# Altium project Quail_2.0.PrjPcb (part 2 of 2)

## Sheet Blink_Blink_Beep_Boop.SchDoc: Blinks and Boops
size Legal; DocumentNumber: 8; SheetNumber: 8; SheetTotal: 8; Project: Olympus
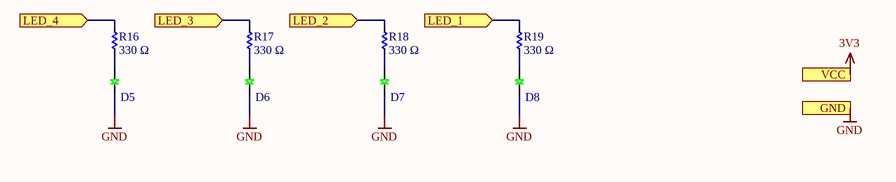
[diagram p4: Blink_Blink_Beep_Boop.SchDoc]

### Parts
(Parts that share a designator on the sheet are numbered #1, #2 ... from top to bottom, then left to right.)
D5  LED_C503B-GCS-CB0C0781  [LED_TH_5MM]  (value not drawn)
D6  LED_C503B-GCS-CB0C0781  [LED_TH_5MM]  (value not drawn)
D7#1  LED_C503B-GCS-CB0C0781  [LED_TH_5MM]  (value not drawn)
D8#1  LED_C503B-GCS-CB0C0781  [LED_TH_5MM]  (value not drawn)
R16  Resistance: 330 Ω  [R0603]  (hidden comment: 311-330HRCT-ND)
R17  Resistance: 330 Ω  [R0603]  (hidden comment: 311-330HRCT-ND)
R18  Resistance: 330 Ω  [R0603]  (hidden comment: 311-330HRCT-ND)
R19  Resistance: 330 Ω  [R0603]  (hidden comment: 311-330HRCT-ND)

### Ports
GND (in), LED_1 (in), LED_2 (in), LED_3 (in), LED_4 (in), VCC (in)

### Nets
GND: D5.2(K) D6.2(K) D7#1.2(K) D8#1.2(K) ; port GND
LED1: R19.2 ; port LED_1
LED2: R18.2 ; port LED_2
LED3: R17.2 ; port LED_3
LED4: R16.2 ; port LED_4
NetD5_1: D5.1(A) R16.1
NetD6_1: D6.1(A) R17.1
NetD7#1_1: D7#1.1(A) R18.1
NetD8#1_1: D8#1.1(A) R19.1

### Notes on the sheet
- PROJECT
- SHEET
- Powered By
- Sheet
- of
- REVISION
- ssi.stanford.edu
- ENGINEER
- REVIEWER
- REVIEWED ON

### Library data of the parts
D5 D6 D7#1 D8#1 = CMP-033-0070-3: LED GREEN CLEAR 5MM ROUND T/H; Manufacturer: Cree; Lens Colour: Colorless; Luminous Intensity: 24850mcd; Viewing Angle: 30°; Forward Current: 20mA; Forward Voltage: 3.2V; Lens Style: Dome; Dominant Wavelength: 527nm; Power Rating: 120mW; Reverse Voltage (DC): 5V; Number of LEDs: 1; Manufacturer Part Number: C503B-GCS-CB0C0781; Stock 1: 191; Pricing 1: 1=0.25, 10=0.236, 100=0.2184, 1000=0.1954, 50000=0.1814 (USD); Mount: Through Hole; Case/Package: Radial; Colour: Green; Min Operating Temperature: -40°C; Max Operating Temperature: 95°C; Illumination Colour: Green; Packaging: Bulk; Package Quantity: 500; Lens Transparency: Clear; Test Current: 20mA; Wavelength: 527nm; Length: 5.8mm; Height: 12.7mm; Width: 5mm; ComponentLink1URL: http://www.mouser.com/ds/2/90/cree.C503B%20BAS%20BAN%20BCS%20BCN%20GAS%20GAN%20GCS%20GCN%201094[1]-310350.pdf; ComponentLink1Description: http://www.mouser.com/ds/2/90/cree.C503B%20BAS%20BAN%20BCS%20BCN%20GAS%20GAN%20GCS%20GCN%201094[1]-310350.pdf; ComponentLink2URL: http://www.cree.com/led-components/media/documents/C503B-BAS-BAN-BCS-BCN-GAS-GAN-GCS-GCN-1094.pdf; ComponentLink2Description: http://www.cree.com/led-components/media/documents/C503B-BAS-BAN-BCS-BCN-GAS-GAN-GCS-GCN-1094.pdf; Design Item ID: LED_C503B-GCS-CB0C0781; Source: diode.SchLib
R16-R19 = CMP-126-0120-2: RES SMD 330 OHM 1% 1/10W 0603; Manufacturer Part Number: RC0603FR-07330RL; Manufacturer: Yageo; Resistance (Sortable): 330; Power (Watts): 0.1W, 1/10W; Temperature Coefficient: ±100ppm/°C; Datasheets: http://www.yageo.com/documents/recent/PYu-RC_Group_51_RoHS_L_9.pdf; Image: //media.digikey.com/Renders/Yageo%20Renders/0603-(1608-Metric).jpg; Tolerance: ±1%; Operating Temperature: -55°C ~ 155°C

## Sheet SAMD51.SchDoc
size A3
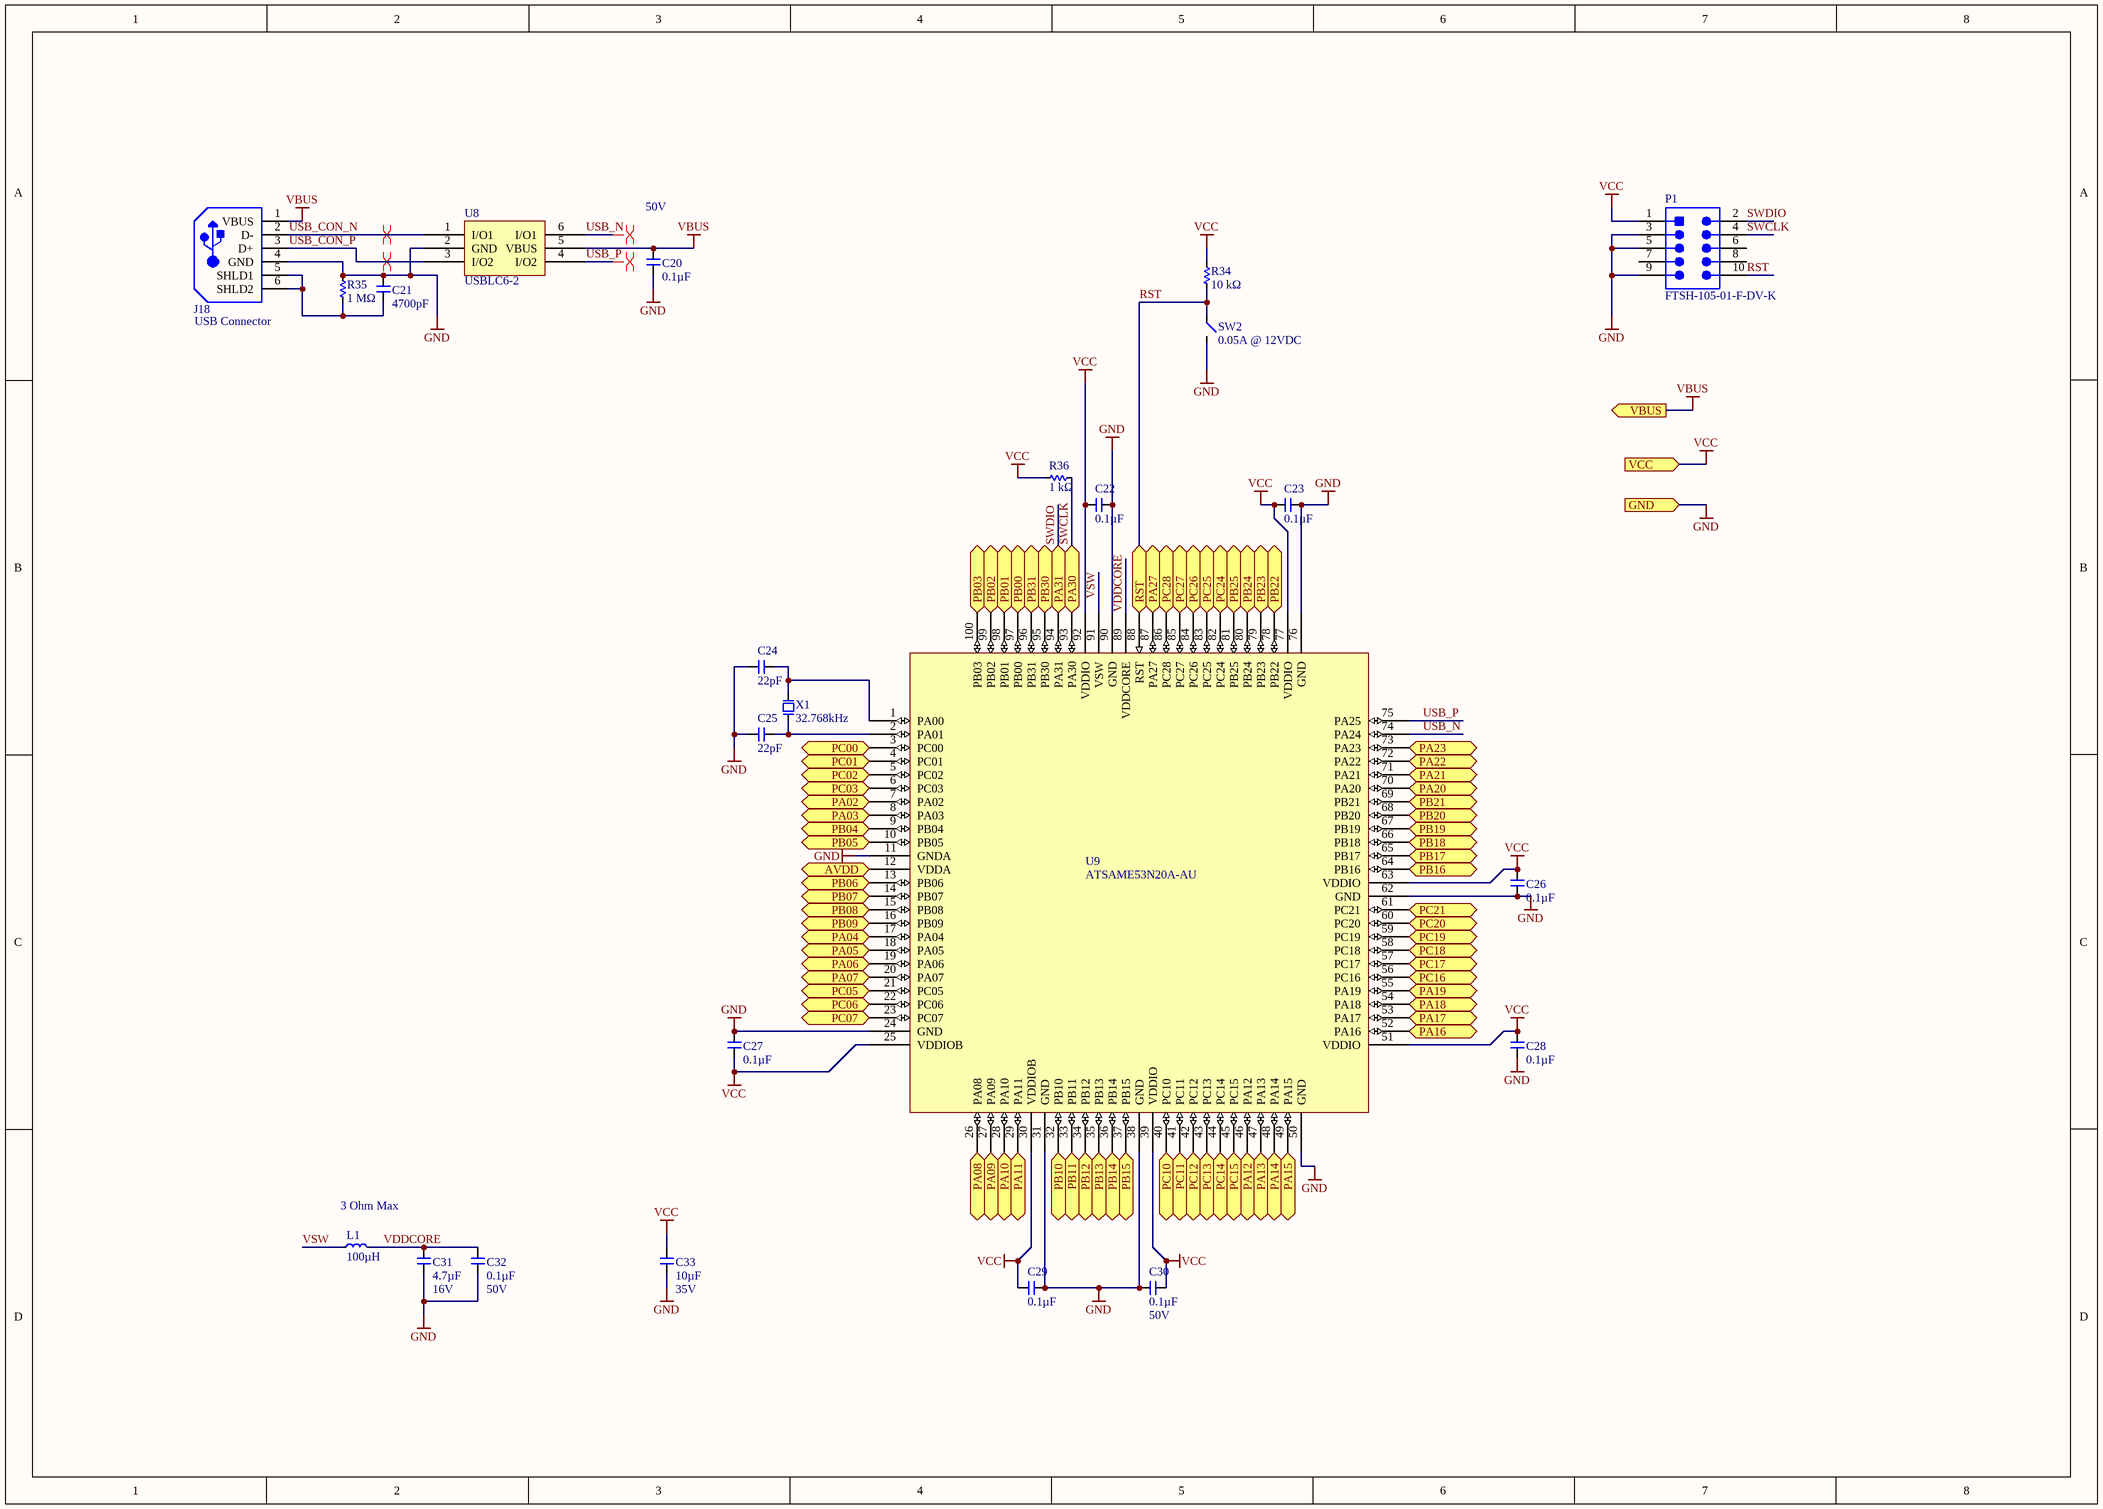
[diagram p5: SAMD51.SchDoc]

### Parts
(Parts that share a designator on the sheet are numbered #1, #2 ... from top to bottom, then left to right.)
C20  Capacitance (shorthand): 0.1µF  Rated Voltage: 50V  [C0603]  (hidden comment: 490-1519-1-ND)
C21  Capacitance (shorthand): 4700pF  [C0603]  (hidden comment: 490-1506-1-ND)
C22#1  Capacitance (shorthand): 0.1µF  [C0603]  (hidden comment: 490-1519-1-ND)
C23#1  Capacitance (shorthand): 0.1µF  [C0603]  (hidden comment: 490-1519-1-ND)
C24#1  Capacitance (shorthand): 22pF  [C0603]  (hidden comment: 490-1411-1-ND)
C25#1  Capacitance (shorthand): 22pF  [C0603]  (hidden comment: 490-1411-1-ND)
C26#1  Capacitance (shorthand): 0.1µF  [C0603]  (hidden comment: 490-1519-1-ND)
C27#1  Capacitance (shorthand): 0.1µF  [C0603]  (hidden comment: 490-1519-1-ND)
C28  Capacitance (shorthand): 0.1µF  [C0603]  (hidden comment: 490-1519-1-ND)
C29  Capacitance (shorthand): 0.1µF  [C0603]  (hidden comment: 490-1519-1-ND)
C30  Capacitance (shorthand): 0.1µF  Rated Voltage: 50V  [C0603]  (hidden comment: 490-1519-1-ND)
C31  Capacitance (shorthand): 4.7µF  Rated Voltage: 16V  [C0603]  (hidden comment: 311-1785-1-ND)
C32  Capacitance (shorthand): 0.1µF  Rated Voltage: 50V  [C0603]  (hidden comment: 490-1519-1-ND)
C33  Capacitance (shorthand): 10µF  Rated Voltage: 35V  [C0603]  (hidden comment: 490-13248-1-ND)
J18#1  USBR-B-S-S-O-TH  [SMTC-USBR-TH-4_V]  (value not drawn)
L1  DC Resistance (DCR): 3 Ohm Max  Inductance: 100µH  [C1210]  (hidden comment: IND_BRL3225T101K)
P1  FTSH-105-01-F-DV-K  [SMTC-FTSH-105-01-L-DV-K_V]
R34#1  Resistance: 10 kΩ  [R0603]  (hidden comment: 311-10.0KHRCT-ND)
R35#1  Resistance: 1 MΩ  [R0603]  (hidden comment: 311-1.00MHRCT-ND)
R36#1  Resistance: 1 kΩ  [R0603]  (hidden comment: 311-1.00KHRCT-ND)
SW2  Contact Rating @ Voltage: 0.05A @ 12VDC  [SWITCH_FSM4JSMATR]  (hidden comment: SWITCH_FSM4JSMATR)
U8  USBLC6-2  [6SOT23]
U9  ATSAME53N20A-AU  [TSQFP50P1600X1600X120-100N]
X1  Frequency: 32.768kHz  [XTAL_TXC_9HT10]  (hidden comment: XTAL_9HT10-32.768KEZF-T)

### Ports
AVDD (bidir), GND (in), PA02 (bidir), PA03 (bidir), PA04 (bidir), PA05 (bidir), PA06 (bidir), PA07 (bidir), PA08 (bidir), PA09 (bidir), PA10 (bidir), PA11 (bidir), PA12 (bidir), PA13 (bidir), PA14 (bidir), PA15 (bidir), PA16 (bidir), PA17 (bidir), PA18 (bidir), PA19 (bidir), PA20 (bidir), PA21 (bidir), PA22 (bidir), PA23 (bidir), PA27 (bidir), PA30 (bidir), PA31 (bidir), PB00 (bidir), PB01 (bidir), PB02 (bidir), PB03 (bidir), PB04 (bidir), PB05 (bidir), PB06 (bidir), PB07 (bidir), PB08 (bidir), PB09 (bidir), PB10 (bidir), PB11 (bidir), PB12 (bidir), PB13 (bidir), PB14 (bidir), PB15 (bidir), PB16 (bidir), PB17 (bidir), PB18 (bidir), PB19 (bidir), PB20 (bidir), PB21 (bidir), PB22 (bidir), PB23 (bidir), PB24 (bidir), PB25 (bidir), PB30 (bidir), PB31 (bidir), PC00 (bidir), PC01 (bidir), PC02 (bidir), PC03 (bidir), PC05 (bidir), PC06 (bidir), PC07 (bidir), PC10 (bidir), PC11 (bidir), PC12 (bidir), PC13 (bidir), PC14 (bidir), PC15 (bidir), PC16 (bidir), PC17 (bidir), PC18 (bidir), PC19 (bidir), PC20 (bidir), PC21 (bidir), PC24 (bidir), PC25 (bidir), PC26 (bidir), PC27 (bidir), PC28 (bidir), RST (bidir), VBUS (out), VCC (in)

### Nets
GND: C20.2 C21.1 C22#1.1 C23#1.1 C24#1.1 C25#1.1 C26#1.1 C27#1.1 C28.1 C29.2 C30.2 C31.1 C32.2 C33.1 J18#1.4(GND) P1.3 P1.5 P1.9 R35#1.2 SW2.2 U8.2(GND) U9.11(GNDA) U9.24(GND) U9.31(GND) U9.38(GND) U9.50(GND) U9.62(GND) U9.76(GND) U9.90(GND) ; port GND
VBUS: C20.1 J18#1.1(VBUS) U8.5(VBUS) ; port VBUS
VCC: C22#1.2 C23#1.2 C26#1.2 C27#1.2 C28.2 C29.1 C30.1 C33.2 P1.1 R34#1.1 R36#1.2 U9.12(VDDA) U9.25(VDDIOB) U9.30(VDDIOB) U9.39(VDDIO) U9.51(VDDIO) U9.63(VDDIO) U9.77(VDDIO) U9.92(VDDIO) ; port VCC, port AVDD  [project net 3V3]
ADC_SYNC: U9.87(PA27) ; port PA27
BatterySense: U9.15(PB08) ; port PB08
BUSY: U9.83(PC25) ; port PC25
CAN_STBY_1: U9.68(PB20) ; port PB20
CurrentSense: U9.16(PB09) ; port PB09
DIO1: U9.82(PC24) ; port PC24
ETH_INT: U9.96(PB31) ; port PB31
GPS_PPS: U9.78(PB22) ; port PB22
LED1: U9.64(PB16) ; port PB16
LED2: U9.65(PB17) ; port PB17
LED3: U9.66(PB18) ; port PB18
LED4: U9.67(PB19) ; port PB19
NRESET: U9.84(PC26) ; port PC26
PWR_FLT: U9.6(PC03) ; port PC03
RST: P1.10 R34#1.2 SW2.1 U9.88(RST) ; port RST
SD_CLK: U9.33(PB11) ; port PB11
SD_CMD: U9.26(PA08) ; port PA08
SD_DAT0: U9.27(PA09) ; port PA09
SD_DAT1: U9.28(PA10) ; port PA10
SD_DAT2: U9.29(PA11) ; port PA11
SD_DAT3: U9.32(PB10) ; port PB10
SOLENOID_1: U9.45(PC15) ; port PC15
SOLENOID_2: U9.44(PC14) ; port PC14
SOLENOID_3: U9.43(PC13) ; port PC13
SOLENOID_4: U9.42(PC12) ; port PC12
SOLENOID_5: U9.41(PC11) ; port PC11
SOLENOID_6: U9.40(PC10) ; port PC10
SOLENOID_7: U9.20(PA07) ; port PA07
SOLENOID_8: U9.19(PA06) ; port PA06
SOLENOID_9: U9.18(PA05) ; port PA05
SOLENOID_10: U9.17(PA04) ; port PA04
SOLENOID_11: U9.14(PB07) ; port PB07
SOLENOID_12: U9.13(PB06) ; port PB06
SQB_CS: U9.58(PC18) ; port PC18
SQB_MICO: U9.59(PC19) ; port PC19
SQB_MOCI: U9.57(PC17) ; port PC17
SQB_SCK: U9.56(PC16) ; port PC16
SWCLK: P1.4 R36#1.1 U9.93(PA30) ; port PA30
SWDIO: P1.2 U9.94(PA31) ; port PA31
USB_CON_N: J18#1.2(D-) U8.1(I/O1)
USB_CON_P: J18#1.3(D+) U8.3(I/O2)
USB_N: U8.6(I/O1) U9.74(PA24)
USB_P: U8.4(I/O2) U9.75(PA25)
VDDCORE: C31.2 C32.1 L1.1 U9.89(VDDCORE)
VSW: L1.2 U9.91(VSW)
NetC21_2: C21.2 J18#1.5(SHLD1) J18#1.6(SHLD2) R35#1.1
NetC24#1_2: C24#1.2 U9.1(PA00) X1.2
NetC25#1_2: C25#1.2 U9.2(PA01) X1.1
NetTP1_1: U9.23(PC07) ; port PC07
NetTP2_1: U9.22(PC06) ; port PC06
NetTP3_1: U9.21(PC05) ; port PC05
NetTP30_1: U9.10(PB05) ; port PB05
NetTP31_1: U9.95(PB30) ; port PB30
NetTP32_1: U9.52(PA16) ; port PA16
NetTP33_1: U9.61(PC21) ; port PC21
NetTP34_1: U9.9(PB04) ; port PB04
NetTP35_1: U9.97(PB00) ; port PB00
NetTP36_1: U9.98(PB01) ; port PB01
NetTP37_1: U9.99(PB02) ; port PB02
NetTP38_1: U9.100(PB03) ; port PB03
NetTP39_1: U9.8(PA03) ; port PA03
NetTP40_1: U9.7(PA02) ; port PA02
NetTP41_1: U9.3(PC00) ; port PC00
NetTP42_1: U9.4(PC01) ; port PC01
NetTP43_1: U9.5(PC02) ; port PC02
NetU9_34: U9.34(PB12) ; port PB12
NetU9_35: U9.35(PB13) ; port PB13
NetU9_36: U9.36(PB14) ; port PB14
NetU9_37: U9.37(PB15) ; port PB15
NetU9_46: U9.46(PA12) ; port PA12
NetU9_47: U9.47(PA13) ; port PA13
NetU9_48: U9.48(PA14) ; port PA14
NetU9_49: U9.49(PA15) ; port PA15
NetU9_53: U9.53(PA17) ; port PA17
NetU9_54: U9.54(PA18) ; port PA18
NetU9_55: U9.55(PA19) ; port PA19
NetU9_60: U9.60(PC20) ; port PC20
NetU9_69: U9.69(PB21) ; port PB21
NetU9_70: U9.70(PA20) ; port PA20
NetU9_71: U9.71(PA21) ; port PA21
NetU9_72: U9.72(PA22) ; port PA22
NetU9_73: U9.73(PA23) ; port PA23
NetU9_79: U9.79(PB23) ; port PB23
NetU9_80: U9.80(PB24) ; port PB24
NetU9_81: U9.81(PB25) ; port PB25
NetU9_85: U9.85(PC27) ; port PC27
NetU9_86: U9.86(PC28) ; port PC28

Not connected (* = marked no-connect by the designer): P1 6 7 8

### Layout directives
differential pair: USB_CON_N, USB_CON_P, USB_N, USB_P

### Notes on the sheet
- (near J18#1) USB Connector
- Title
- Size:
- Date:
- A4
- Number:
- Time:
- Revision:
- Sheet
- of
- File:

### Library data of the parts
C20 C22#1 C23#1 C26#1 C27#1 C28-C30 C32 = CMP-119-0065-1: CAP CER 0603 0.1µF X7R 50V 10%; Manufacturer: Murata Electronics North America; Capacitance - pF (Machine readable): #NAME?; Dielectric: X7R
  C22#1 C23#1 C26#1 C27#1 C28 C29: Rated Voltage: 50V
C21 = CMP-119-0049-1: CAP CER 0603 4700pF X7R 50V 10%; Manufacturer: Murata Electronics North America; Capacitance - pF (Machine readable): #NAME?; Dielectric: X7R; Rated Voltage: 50V
C24#1 C25#1 = CMP-119-0008-1: CAP CER 22PF 50V C0G/NP0 0603; Manufacturer: Murata Electronics North America; Capacitance - pF (Machine readable): 22; Dielectric: C0G, NP0; Rated Voltage: 50V
C31 = CMP-119-0070-1: CAP CER 4.7UF 16V X5R 0603 10%; Manufacturer: Yageo; Capacitance - pF (Machine readable): #NAME?; Dielectric: X5R
C33 = CMP-119-0071-1: CAP CER 10UF 35V X5R 0603 20%; Manufacturer: Murata Electronics North America; Capacitance - pF (Machine readable): #NAME?; Dielectric: X5R
J18#1 = CMP-00011-3: Conn USB F 4 POS 2.5mm Solder RA Thru-Hole 4 Terminal 1 Port Tray; Max Voltage Rating (AC): 30V; USB Standard: USB 2.0; Number of Contacts: 4; Gender: Receptacle; Number of Ports: 1; Contact Plating: Gold; REACH SVHC: No SVHC; Radiation Hardening: No; Mount: Through Hole,Horizontal; Packaging: Tray; Length: 14.9mm; Max Operating Temperature: 85°C; Termination: Solder; Depth: 16.5mm; Connector Type: USB; Contact Material: Bronze; Pitch: 2.5mm; Series: -; Number of Terminals/Pins: 4; Orientation: Right Angle; Package Quantity: 1; Min Operating Temperature: -50°C; Housing Material: Thermoplastic
L1 = CMP-052-0010-1: INDUCTOR 100UH 270MA 1210 SMD; Manufacturer: Taiyo Yuden; Current - Temperature Rise: 250mA; Tolerance: ±10%; Shielding: Unshielded; Frequency - Self Resonant: 5MHz; Frequency - Test: 100kHz; Manufacturer Part Number: BRL3225T101K; RoHS: RoHS Compliant; Current - Saturation: 270mA; Q @ Freq: -; Applications: Power Supplies; Material - Core: -; Package / Case: 1210 (3225 Metric); Mounting Type: Surface Mount; Packaging: Cut Tape (CT); Operating Temperature: -40°C ~ 105°C; ComponentLink1URL: http://www.yuden.co.jp/ut/product/pdf/wound07_e.pdf; ComponentLink1Description: Datasheet; Current: 270mA; Stock 1: 84687; Source: inductor.SchLib; Pricing 1: 1=0.16, 10=0.155, 50=0.145, 100=0.1354, 500=0.10638, 1000=0.08704 (GBP); Design Item ID: IND_BRL3225T101K
P1 = CMP-2000-05352-1: Male Header, Pitch 1.27 mm, 2 x 5 Position, Height 6.12 mm, RoHS, Tube; Manufacturer: Samtec; Number of Positions: 10; Connector Type: Header,Shrouded; Number of Positions Loaded: All; Row Spacing: 0.050"(1.27mm); Fastening Type: -; Package Reference: FTSH-105-01-L-DV-K; Termination: Solder; Package URL: http://suddendocs.samtec.com/prints/ftsh-1xx-xx-xxx-dv-xxx-footprint.pdf; Number of Rows: 2; Contact Finish Thickness: 3µin(0.08µm); Contact Type: MalePin; Manufacturer URL: http://www.samtec.com/; Series: FTSH; Features: -; Contact Finish: Gold; Color: Black; Family: RectangularConnectors-Headers,MalePins; Datasheet URL: http://suddendocs.samtec.com/prints/ftsh-1xx-xx-xxx-dv-xxx-mkt.pdf; Package Description: Male Header, Pitch 1.27 mm, 2 x 5 Position, Height 5.97 mm, Tail Length 4.32 mm; Mounting Type: SurfaceMount; Datasheet Version: Rev. ET, 10/1995; Category: Connectors,Interconnects; Packaging: Tube; Contact Mating Length: 0.120"(3.05mm); Pitch: 0.050"(1.27mm)
R34#1 = CMP-126-0273-2: RES SMD 10K OHM 1% 1/10W 0603; Manufacturer Part Number: RC0603FR-0710KL; Manufacturer: Yageo; Resistance (Sortable): 10000; Power (Watts): 0.1W, 1/10W; Temperature Coefficient: ±100ppm/°C; Datasheets: http://www.yageo.com/documents/recent/PYu-RC_Group_51_RoHS_L_9.pdf; Image: //media.digikey.com/Renders/Yageo%20Renders/0603-(1608-Metric).jpg; Tolerance: ±1%; Operating Temperature: -55°C ~ 155°C
R35#1 = CMP-126-0484-2: RES SMD 1M OHM 1% 1/10W 0603; Manufacturer Part Number: RC0603FR-071ML; Manufacturer: Yageo; Resistance (Sortable): 1000000; Power (Watts): 0.1W, 1/10W; Temperature Coefficient: ±100ppm/°C; Datasheets: http://www.yageo.com/documents/recent/PYu-RC_Group_51_RoHS_L_9.pdf; Image: //media.digikey.com/Renders/Yageo%20Renders/0603-(1608-Metric).jpg; Tolerance: ±1%; Operating Temperature: -55°C ~ 155°C
R36#1 = CMP-126-0172-2: RES SMD 1K OHM 1% 1/10W 0603; Manufacturer Part Number: RC0603FR-071KL; Manufacturer: Yageo; Resistance (Sortable): 1000; Power (Watts): 0.1W, 1/10W; Temperature Coefficient: ±100ppm/°C; Datasheets: http://www.yageo.com/documents/recent/PYu-RC_Group_51_RoHS_L_9.pdf; Image: //media.digikey.com/Renders/Yageo%20Renders/0603-(1608-Metric).jpg; Tolerance: ±1%; Operating Temperature: -55°C ~ 155°C
SW2 = CMP-062-0009-1: SWITCH TACTILE SPST-NO 0.05A 12V; Manufacturer: TE Connectivity; Switch Function: Off-Mom; Actuator Type: Standard; Actuator Height off PCB, from Pins: 5.00mm; Actuator Orientation: Top Actuated; Outline: 6.00mm x 6.00mm; Illumination: Non-Illuminated; Operating Force: 160gf; Actuator Material: Polyphenylene Sulfide (PPS); Switch Travel: 0.25mm; Mechanical Life: 100,000 Cycles; Manufacturer Part Number: FSM4JSMATR; RoHS: RoHS Compliant; Stock 1: 24144; Pricing 1: 1=0.36, 10=0.34, 25=0.2912, 50=0.2474, 100=0.2377, 250=0.21344, 500=0.20374 (USD); Circuit: SPST-NO; Mounting Type: Surface Mount; Termination Style: Gull Wing; Illumination Voltage (Nominal): -; Illumination Type, Color: -; Ingress Protection: -; Features: -; Packaging: Cut Tape (CT); Operating Temperature: -35°C ~ 85°C; ComponentLink1URL: http://www.te.com/commerce/DocumentDelivery/DDEController?Action=srchrtrv&DocNm=2-1437565-7&DocType=Customer+Drawing&DocLang=English; ComponentLink1Description: Datasheet; Source: miscellaneous.SchLib; Design Item ID: SWITCH_FSM4JSMATR
U8 = CMP-038-0001-1: Manufacturer: STMicroelectronics; Manufacturer Part Number: USBLC6-2SC6; Unidirectional Channels: 2; Voltage - Reverse Standoff (Typ): 5.25V; Voltage - Breakdown (Min): 6V; Voltage - Clamping (Max) @ Ipp: 17V; Current - Peak Pulse (10/1000µs): 5A (8/20µs); Power Line Protection: Yes; RoHS: RoHS Compliant; Stock 1: 31719; Pricing 1: 1=0.51, 10=0.411, 100=0.2802, 500=0.21012, 1000=0.15759 (USD); Packaging: Cut Tape (CT); Part Status: Active; Bidirectional Channels: -; Power - Peak Pulse: -; Applications: Ethernet; Capacitance @ Frequency: -; Operating Temperature: -40°C ~ 125°C (TJ); Mounting Type: Surface Mount; Package / Case: SOT-23-6; Supplier Device Package: SOT-23-6; ComponentLink1URL: http://www.st.com/web/en/resource/technical/document/datasheet/CD00050750.pdf; ComponentLink1Description: http://www.st.com/web/en/resource/technical/document/datasheet/CD00050750.pdf; Design Item ID: USBLC6-2; Source: ic_analog.SchLib
U9 = CMP-025-0003-5: MCU 32-bit ARM Cortex M4F RISC 1MB Flash 3.3V 100-Pin TQFP Tray
X1 = CMP-066-0008-1: CRYSTAL 32.768 KHZ 12.5 PF SMD; Manufacturer: TXC CORPORATION; Frequency Tolerance: ±10ppm; ESR (Equivalent Series Resistance): 70 kOhm; Operating Mode: Fundamental; Load Capacitance: 12.5pF; Manufacturer Part Number: 9HT10-32.768KEZF-T; RoHS: RoHS Compliant; Stock 1: 5250; Pricing 1: 1=1.88, 10=1.625, 50=1.425, 100=1.125, 500=0.95, 1000=0.75 (USD); Frequency Stability: -; Operating Temperature: -40°C ~ 85°C; Ratings: -; Mounting Type: Surface Mount; Package / Case: 2-SMD; Size / Dimension: 0.126" L x 0.059" W (3.20mm x 1.50mm); Height: 0.033" (0.85mm); Packaging: Cut Tape (CT); ComponentLink1URL: http://www.txccrystal.com/images/pdf/9ht10.pdf; ComponentLink1Description: Datasheet; Design Item ID: XTAL_9HT10-32.768KEZF-T; Source: oscillator.SchLib

## Sheet SD.SchDoc
size A4
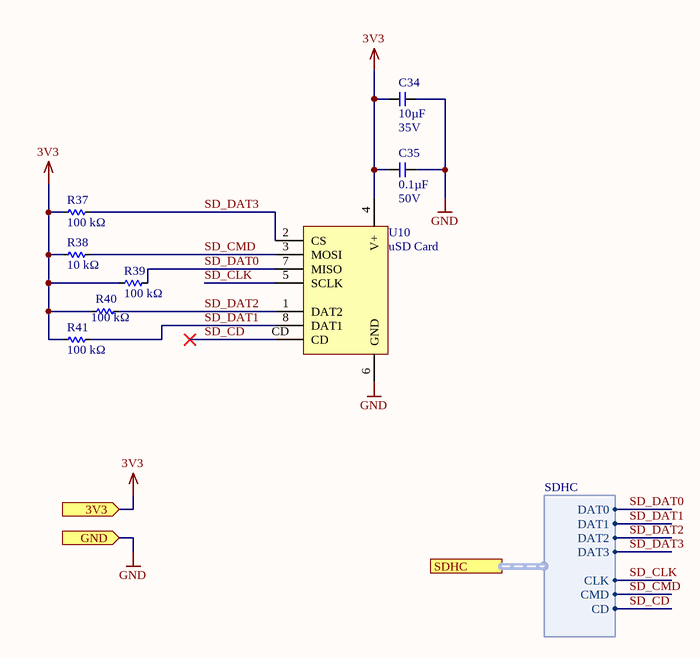
[diagram p6: SD.SchDoc]

### Parts
(Parts that share a designator on the sheet are numbered #1, #2 ... from top to bottom, then left to right.)
C34  Capacitance (shorthand): 10µF  Rated Voltage: 35V  [C0603]  (hidden comment: 490-13248-1-ND)
C35  Capacitance (shorthand): 0.1µF  Rated Voltage: 50V  [C0603]  (hidden comment: 490-1519-1-ND)
R37#1  Resistance: 100 kΩ  [R0603]  (hidden comment: 311-100KHRCT-ND)
R38#1  Resistance: 10 kΩ  [R0603]  (hidden comment: 311-10.0KHRCT-ND)
R39#1  Resistance: 100 kΩ  [R0603]  (hidden comment: 311-100KHRCT-ND)
R40#1  Resistance: 100 kΩ  [R0603]  (hidden comment: 311-100KHRCT-ND)
R41#1  Resistance: 100 kΩ  [R0603]  (hidden comment: 311-100KHRCT-ND)
U10  uSD Card  [MICROSD_CARD_SOCKET]

### Ports
3V3 (in), GND (in), SDHC (harness SDHC)

### Harnesses
SDHC: DAT3, DAT0, DAT2, DAT1, CLK, CMD, CD

### Nets
3V3: C34.2 C35.1 R37#1.1 R38#1.1 R39#1.1 R40#1.1 R41#1.1 U10.4(V+) ; port 3V3
GND: C34.1 C35.2 U10.6(GND) ; port GND
SD_CD: U10.CD ; port SDHC.CD
SD_CLK: U10.5(SCLK) ; port SDHC.CLK
SD_CMD: R38#1.2 U10.3(MOSI) ; port SDHC.CMD
SD_DAT0: R39#1.2 U10.7(MISO) ; port SDHC.DAT0
SD_DAT1: R41#1.2 U10.8(DAT1) ; port SDHC.DAT1
SD_DAT2: R40#1.2 U10.1(DAT2) ; port SDHC.DAT2
SD_DAT3: R37#1.2 U10.2(CS) ; port SDHC.DAT3

### Notes on the sheet
- Title
- Size:
- Date:
- A4
- Number:
- Time:
- Revision:
- Sheet
- of
- File:

### Library data of the parts
C34 = CMP-119-0071-1: as C33 on sheet SAMD51; Dielectric: X5R
C35 = CMP-119-0065-1: as C20 on sheet SAMD51; Dielectric: X7R
R37#1 R39#1 R40#1 R41#1 = CMP-126-0382-2: RES SMD 100K OHM 1% 1/10W 0603; Manufacturer Part Number: RC0603FR-07100KL; Manufacturer: Yageo; Resistance (Sortable): 100000; Power (Watts): 0.1W, 1/10W; Temperature Coefficient: ±100ppm/°C; Datasheets: http://www.yageo.com/documents/recent/PYu-RC_Group_51_RoHS_L_9.pdf; Image: //media.digikey.com/Renders/Yageo%20Renders/0603-(1608-Metric).jpg; Tolerance: ±1%; Operating Temperature: -55°C ~ 155°C
R38#1 = CMP-126-0273-2: as R34#1 on sheet SAMD51; Datasheets: http://www.yageo.com/documents/recent/PYu-RC_Group_51_RoHS_L_9.pdf; Image: //media.digikey.com/Renders/Yageo%20Renders/0603-(1608-Metric).jpg; Tolerance: ±1%; Operating Temperature: -55°C ~ 155°C
U10 = CMP-030-0037-1: MICROSD CARD HOLDER, PUSH-PUSH; Manufacturer: 3M; Manufacturer Part Number: 2908-05WB-MG; Card Type: Secure Digital - microSD™; Number of Positions: 10 (8 + 2); Connector Type: Connector and Ejector; Insertion, Removal Method: Push In, Push Out; RoHS: RoHS Compliant; Stock 1: 32313; Pricing 1: 1=3.6, 10=3.458, 25=3.1704, 50=3.0262, 100=2.882, 250=2.52176, 500=2.4497, 1000=2.08945 (USD); Packaging: Cut Tape (CT); Ejector Side: -; Mounting Type: Surface Mount, Right Angle; Features: Switch; Height Above Board: 0.073" (1.85mm); Mounting Feature: Normal, Standard - Top; Contact Finish: Gold; Contact Finish Thickness: 15µin (0.38µm); ComponentLink1URL: http://multimedia.3m.com/mws/media/416257O/3mtm-card-connector-microsdtm-2900-series-ts2197.pdf; ComponentLink1Description: http://multimedia.3m.com/mws/media/416257O/3mtm-card-connector-microsdtm-2900-series-ts2197.pdf; Source: connector.SchLib; Design Item ID: MICRO_SD_CARD_HOLDER

## Sheet Radio.SchDoc
size Legal
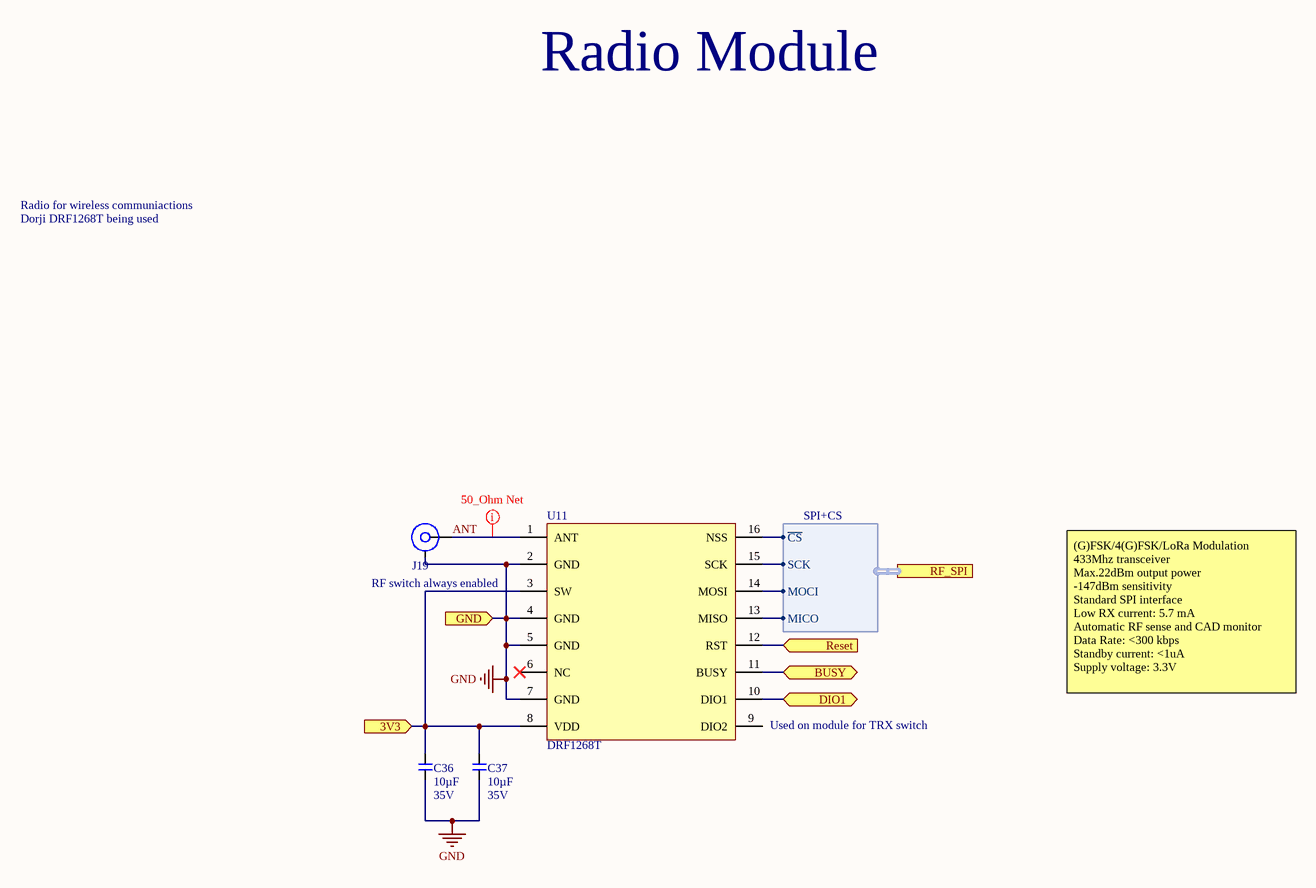
[diagram p7: Radio.SchDoc]

### Parts
(Parts that share a designator on the sheet are numbered #1, #2 ... from top to bottom, then left to right.)
C36  Capacitance (shorthand): 10µF  Rated Voltage: 35V  [C0603]  (hidden comment: 490-13248-1-ND)
C37  Capacitance (shorthand): 10µF  Rated Voltage: 35V  [C0603]  (hidden comment: 490-13248-1-ND)
J19#1  SMA_SAMTEC_TH_RA  [SMA_SAMTEC_SMA-J-P-X-RA-TH1]  (value not drawn)
U11  DRF1268T  [DRF1268T]

### Ports
3V3 (in), BUSY (bidir), DIO1 (bidir), GND (in), Reset (in), RF_SPI (harness SPI+CS)

### Harnesses
SPI+CS: SCK, MOCI, MICO, ~{CS}

### Nets
3V3: C36.1 C37.1 U11.3(SW) U11.8(VDD) ; port 3V3
GND: C36.2 C37.2 J19#1.GND U11.2(GND) U11.4(GND) U11.5(GND) U11.7(GND) ; port GND
ANT: J19#1.SIG U11.1(ANT)
BUSY: U11.11(BUSY) ; port BUSY
DIO1: U11.10(DIO1) ; port DIO1
NRESET: U11.12(RST) ; port Reset
NetU9_70: U11.13(MISO) ; port RF_SPI.MICO
NetU9_71: U11.16(NSS) ; port RF_SPI.~{CS}
NetU9_72: U11.15(SCK) ; port RF_SPI.SCK
NetU9_73: U11.14(MOSI) ; port RF_SPI.MOCI

Not connected (* = marked no-connect by the designer): U11 6(NC)* 9(DIO2)

### Layout directives
rule Clearance Constraint [Generic clearance = 0mil, and 21 value(s) for objects]: ANT

### Notes on the sheet
- Radio Module
- Radio for wireless communiactions
- Dorji DRF1268T being used
- RF switch always enabled
- (near U11) Used on module for TRX switch
- (G)FSK/4(G)FSK/LoRa Modulation
  433Mhz transceiver
  Max.22dBm output power
  -147dBm sensitivity
  Standard SPI interface
  Low RX current: 5.7 mA
  Automatic RF sense and CAD monitor
  Data Rate: <300 kbps
  Standby current: <1uA
  Supply voltage: 3.3V
- PROJECT
- SHEET
- Powered By
- Sheet
- of
- REVISION
- ssi.stanford.edu
- ENGINEER
- REVIEWER
- REVIEWED ON

### Library data of the parts
C36 C37 = CMP-119-0071-1: as C33 on sheet SAMD51; Dielectric: X5R
J19#1 = CMP-030-0020-1: Source: connector.SchLib; Design Item ID: SMA_SAMTEC_TH_RA
U11 = CMP-025-0002-1: Dorji DRF1268T LoRa Module with SX1262 IC and TCXO; Design Item ID: RFM_Module

## Sheet SolenoidsAndPressure.SchDoc: Solenoids & Pressure Transducers
size Legal; DocumentNumber: 8; SheetNumber: 8; SheetTotal: 8; Project: Olympus
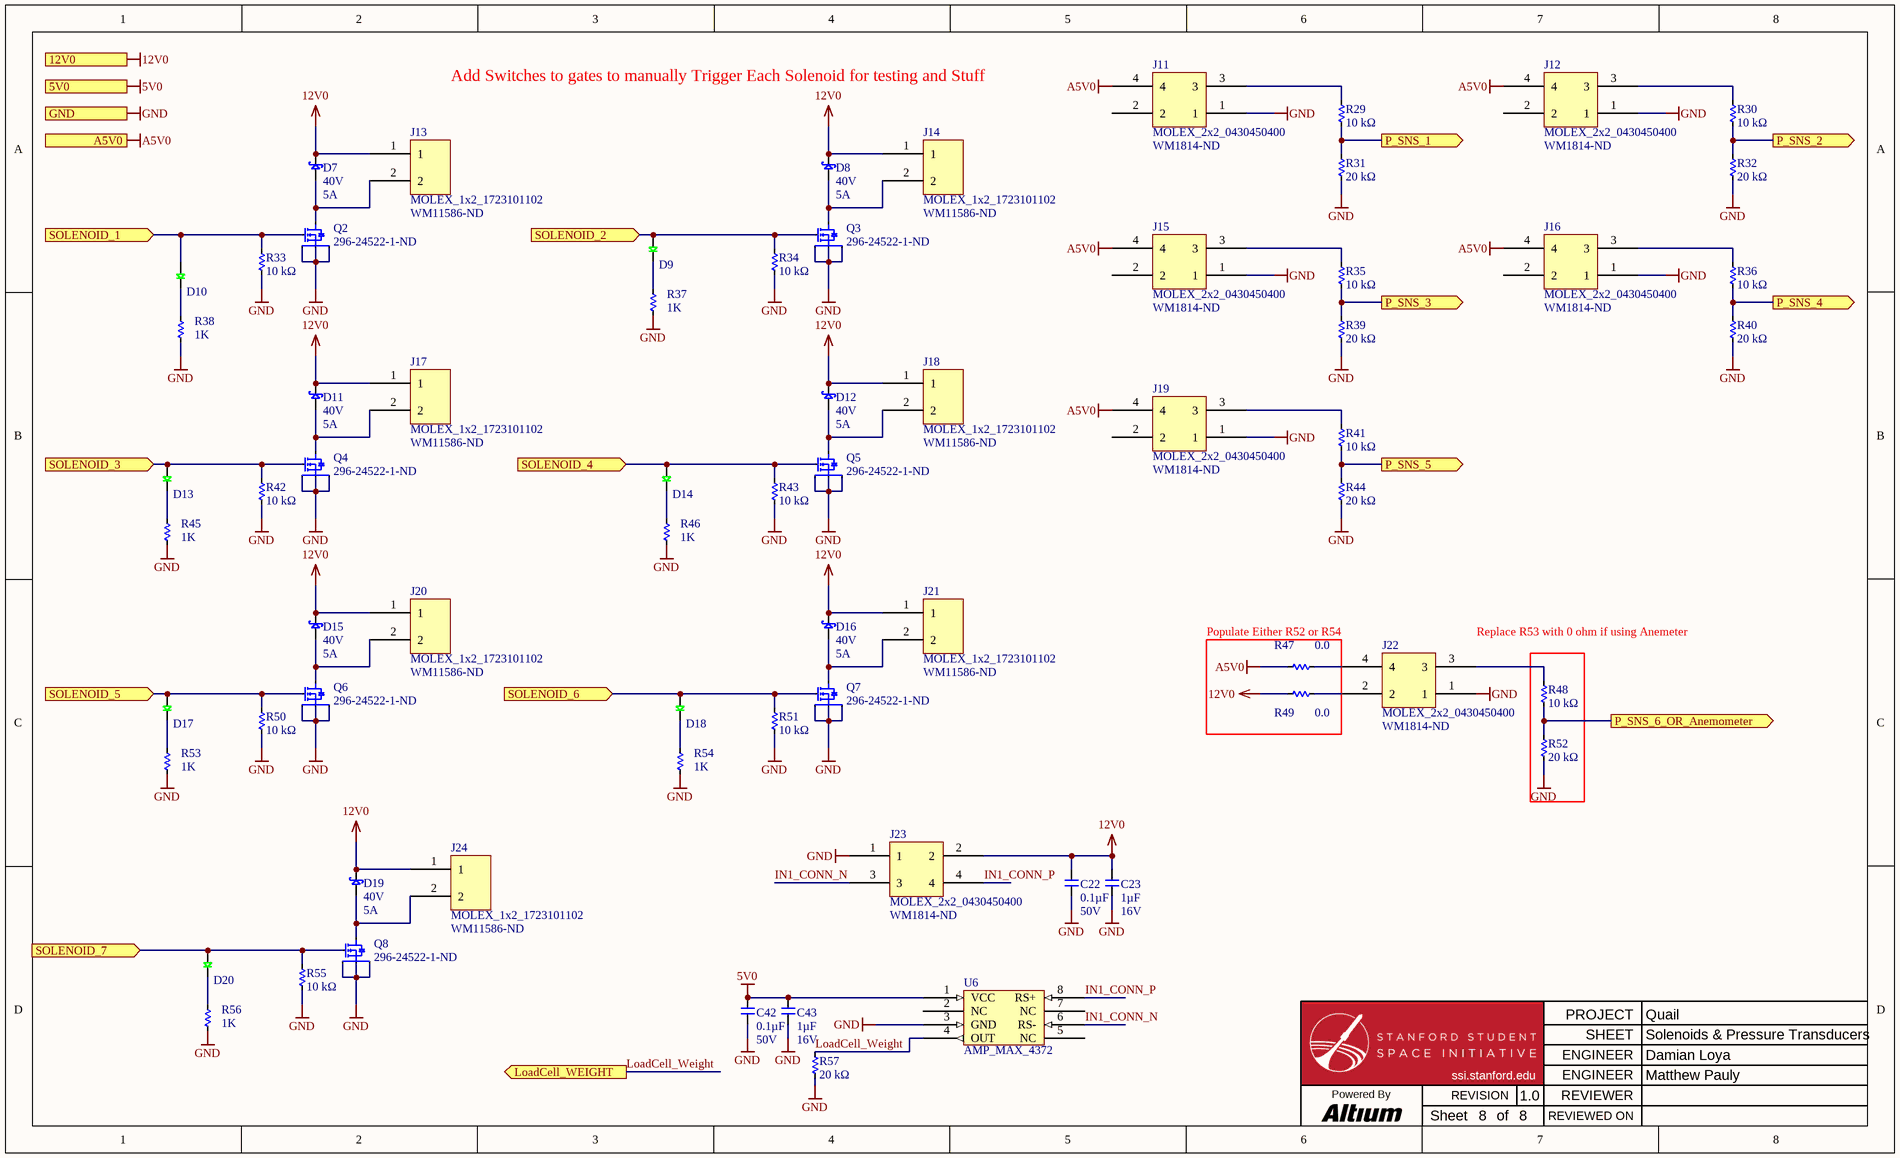
[diagram p8: SolenoidsAndPressure.SchDoc]

### Parts
(Parts that share a designator on the sheet are numbered #1, #2 ... from top to bottom, then left to right.)
C22#2  Capacitance (shorthand): 0.1µF  Rated Voltage: 50V  [C0603P]  (hidden comment: __template_cap)
C23#2  Capacitance (shorthand): 1µF  Rated Voltage: 16V  [C0603P]  (hidden comment: __template_cap)
C42  Capacitance (shorthand): 0.1µF  Rated Voltage: 50V  [C0603P]  (hidden comment: __template_cap)
C43  Capacitance (shorthand): 1µF  Rated Voltage: 16V  [C0603P]  (hidden comment: __template_cap)
D7#2  Voltage - DC Reverse (Vr) (Max): 40V  Current - Average Rectified (Io): 5A  [SMC]  (hidden comment: DIODE SCHOTTKY 40V 5A SMC)
D8#2  Voltage - DC Reverse (Vr) (Max): 40V  Current - Average Rectified (Io): 5A  [SMC]  (hidden comment: DIODE SCHOTTKY 40V 5A SMC)
D9  LED_C503B-GCS-CB0C0781  [LED_TH_5MM]  (value not drawn)
D10  LED_C503B-GCS-CB0C0781  [LED_TH_5MM]  (value not drawn)
D11#2  Voltage - DC Reverse (Vr) (Max): 40V  Current - Average Rectified (Io): 5A  [SMC]  (hidden comment: DIODE SCHOTTKY 40V 5A SMC)
D12#2  Voltage - DC Reverse (Vr) (Max): 40V  Current - Average Rectified (Io): 5A  [SMC]  (hidden comment: DIODE SCHOTTKY 40V 5A SMC)
D13#2  LED_C503B-GCS-CB0C0781  [LED_TH_5MM]  (value not drawn)
D14#2  LED_C503B-GCS-CB0C0781  [LED_TH_5MM]  (value not drawn)
D15  Voltage - DC Reverse (Vr) (Max): 40V  Current - Average Rectified (Io): 5A  [SMC]  (hidden comment: DIODE SCHOTTKY 40V 5A SMC)
D16  Voltage - DC Reverse (Vr) (Max): 40V  Current - Average Rectified (Io): 5A  [SMC]  (hidden comment: DIODE SCHOTTKY 40V 5A SMC)
D17  LED_C503B-GCS-CB0C0781  [LED_TH_5MM]  (value not drawn)
D18  LED_C503B-GCS-CB0C0781  [LED_TH_5MM]  (value not drawn)
D19  Voltage - DC Reverse (Vr) (Max): 40V  Current - Average Rectified (Io): 5A  [SMC]  (hidden comment: DIODE SCHOTTKY 40V 5A SMC)
D20  LED_C503B-GCS-CB0C0781  [LED_TH_5MM]  (value not drawn)
J11  MOLEX_2x2_0430450400  Supplier Part Number 1: WM1814-ND  [MOLEX_2x2_0430450400]
J12  MOLEX_2x2_0430450400  Supplier Part Number 1: WM1814-ND  [MOLEX_2x2_0430450400]
J13  MOLEX_1x2_1723101102  Supplier Part Number 1: WM11586-ND  [MOLEX_1x2_1723101102]
J14  MOLEX_1x2_1723101102  Supplier Part Number 1: WM11586-ND  [MOLEX_1x2_1723101102]
J15  MOLEX_2x2_0430450400  Supplier Part Number 1: WM1814-ND  [MOLEX_2x2_0430450400]
J16  MOLEX_2x2_0430450400  Supplier Part Number 1: WM1814-ND  [MOLEX_2x2_0430450400]
J17  MOLEX_1x2_1723101102  Supplier Part Number 1: WM11586-ND  [MOLEX_1x2_1723101102]
J18#2  MOLEX_1x2_1723101102  Supplier Part Number 1: WM11586-ND  [MOLEX_1x2_1723101102]
J19#2  MOLEX_2x2_0430450400  Supplier Part Number 1: WM1814-ND  [MOLEX_2x2_0430450400]
J20  MOLEX_1x2_1723101102  Supplier Part Number 1: WM11586-ND  [MOLEX_1x2_1723101102]
J21  MOLEX_1x2_1723101102  Supplier Part Number 1: WM11586-ND  [MOLEX_1x2_1723101102]
J22  MOLEX_2x2_0430450400  Supplier Part Number 1: WM1814-ND  [MOLEX_2x2_0430450400]
J23  MOLEX_2x2_0430450400  Supplier Part Number 1: WM1814-ND  [MOLEX_2x2_0430450400]
J24  MOLEX_1x2_1723101102  Supplier Part Number 1: WM11586-ND  [MOLEX_1x2_1723101102]
Q2  Supplier Part Number 1: 296-24522-1-ND  [8-VSON]  (hidden comment: NFET_CSD16323Q3)
Q3#2  Supplier Part Number 1: 296-24522-1-ND  [8-VSON]  (hidden comment: NFET_CSD16323Q3)
Q4#2  Supplier Part Number 1: 296-24522-1-ND  [8-VSON]  (hidden comment: NFET_CSD16323Q3)
Q5  Supplier Part Number 1: 296-24522-1-ND  [8-VSON]  (hidden comment: NFET_CSD16323Q3)
Q6  Supplier Part Number 1: 296-24522-1-ND  [8-VSON]  (hidden comment: NFET_CSD16323Q3)
Q7  Supplier Part Number 1: 296-24522-1-ND  [8-VSON]  (hidden comment: NFET_CSD16323Q3)
Q8  Supplier Part Number 1: 296-24522-1-ND  [8-VSON]  (hidden comment: NFET_CSD16323Q3)
R29  Resistance: 10 kΩ  [R0603]  (hidden comment: __template_resistor)
R30  Resistance: 10 kΩ  [R0603]  (hidden comment: __template_resistor)
R31  Resistance: 20 kΩ  [R0603]  (hidden comment: __template_resistor)
R32  Resistance: 20 kΩ  [R0603]  (hidden comment: __template_resistor)
R33  Resistance: 10 kΩ  [R0603]  (hidden comment: __template_resistor)
R34#2  Resistance: 10 kΩ  [R0603]  (hidden comment: __template_resistor)
R35#2  Resistance: 10 kΩ  [R0603]  (hidden comment: __template_resistor)
R36#2  Resistance: 10 kΩ  [R0603]  (hidden comment: __template_resistor)
R37#2  value 1K  [R0603]  (hidden comment: __template_resistor)
R38#2  value 1K  [R0603]  (hidden comment: __template_resistor)
R39#2  Resistance: 20 kΩ  [R0603]  (hidden comment: __template_resistor)
R40#2  Resistance: 20 kΩ  [R0603]  (hidden comment: __template_resistor)
R41#2  Resistance: 10 kΩ  [R0603]  (hidden comment: __template_resistor)
R42  Resistance: 10 kΩ  [R0603]  (hidden comment: __template_resistor)
R43  Resistance: 10 kΩ  [R0603]  (hidden comment: __template_resistor)
R44  Resistance: 20 kΩ  [R0603]  (hidden comment: __template_resistor)
R45  value 1K  [R0603]  (hidden comment: __template_resistor)
R46  value 1K  [R0603]  (hidden comment: __template_resistor)
R47  Resistance (Ohms): 0.0  [R0805]  (hidden comment: RES_0.0_OHM_1/8W_JUMP_0805_SMD)
R48  Resistance: 10 kΩ  [R0603]  (hidden comment: __template_resistor)
R49  Resistance (Ohms): 0.0  [R0805]  (hidden comment: RES_0.0_OHM_1/8W_JUMP_0805_SMD)
R50  Resistance: 10 kΩ  [R0603]  (hidden comment: __template_resistor)
R51  Resistance: 10 kΩ  [R0603]  (hidden comment: __template_resistor)
R52  Resistance: 20 kΩ  [R0603]  (hidden comment: __template_resistor)
R53  value 1K  [R0603]  (hidden comment: __template_resistor)
R54  value 1K  [R0603]  (hidden comment: __template_resistor)
R55  Resistance: 10 kΩ  [R0603]  (hidden comment: __template_resistor)
R56  value 1K  [R0603]  (hidden comment: __template_resistor)
R57  Resistance: 20 kΩ  [R0603]  (hidden comment: __template_resistor)
U6#2  AMP_MAX_4372  [8SOIC150E]

### Blocks framed on the sheet
Populate Either R52 or R54: R47 R49

### Ports
5V0 (in), 12V0 (in), A5V0 (in), GND (in), LoadCell_WEIGHT (out), P_SNS_1 (out), P_SNS_2 (out), P_SNS_3 (out), P_SNS_4 (out), P_SNS_5 (out), P_SNS_6_OR_Anemometer (out), SOLENOID_1 (in), SOLENOID_2 (in), SOLENOID_3 (in), SOLENOID_4 (in), SOLENOID_5 (in), SOLENOID_6 (in), SOLENOID_7 (in)

### Nets
5V0: C42.1 C43.1 U6#2.1(VCC) ; port 5V0
12V0: C22#2.1 C23#2.1 D7#2.2 D8#2.2 D11#2.2 D12#2.2 D15.2 D16.2 D19.2 J13.1 J14.1 J17.1 J18#2.1 J20.1 J21.1 J23.2 J24.1 R49.1 ; port 12V0
A5V0: J11.4 J12.4 J15.4 J16.4 J19#2.4 R47.1 ; port A5V0
GND: C22#2.2 C23#2.2 C42.2 C43.2 J11.1 J12.1 J15.1 J16.1 J19#2.1 J22.1 J23.1 Q2.1(S) Q2.2(S) Q2.3(S) Q3#2.1(S) Q3#2.2(S) Q3#2.3(S) Q4#2.1(S) Q4#2.2(S) Q4#2.3(S) Q5.1(S) Q5.2(S) Q5.3(S) Q6.1(S) Q6.2(S) Q6.3(S) Q7.1(S) Q7.2(S) Q7.3(S) Q8.1(S) Q8.2(S) Q8.3(S) R31.1 R32.1 R33.1 R34#2.1 R37#2.1 R38#2.1 R39#2.1 R40#2.1 R42.1 R43.1 R44.1 R45.1 R46.1 R50.1 R51.1 R52.1 R53.1 R54.1 R55.1 R56.1 R57.1 U6#2.3(GND) ; port GND
IN1_CONN_N: J23.3 U6#2.6(RS-)
IN1_CONN_P: J23.4 U6#2.8(RS+)
LoadCell_Weight: R57.2 U6#2.4(OUT) ; port LoadCell_WEIGHT
NetD7#2_1: D7#2.1 J13.2 Q2.5(D)
NetD8#2_1: D8#2.1 J14.2 Q3#2.5(D)
NetD9_1: D9.1 Q3#2.4(G) R34#2.2 ; port SOLENOID_2
NetD9_2: D9.2 R37#2.2
NetD10_1: D10.1 Q2.4(G) R33.2 ; port SOLENOID_1
NetD10_2: D10.2 R38#2.2
NetD11#2_1: D11#2.1 J17.2 Q4#2.5(D)
NetD12#2_1: D12#2.1 J18#2.2 Q5.5(D)
NetD13#2_1: D13#2.1 Q4#2.4(G) R42.2 ; port SOLENOID_3
NetD13#2_2: D13#2.2 R45.2
NetD14#2_1: D14#2.1 Q5.4(G) R43.2 ; port SOLENOID_4
NetD14#2_2: D14#2.2 R46.2
NetD15_1: D15.1 J20.2 Q6.5(D)
NetD16_1: D16.1 J21.2 Q7.5(D)
NetD17_1: D17.1 Q6.4(G) R50.2 ; port SOLENOID_5
NetD17_2: D17.2 R53.2
NetD18_1: D18.1 Q7.4(G) R51.2 ; port SOLENOID_6
NetD18_2: D18.2 R54.2
NetD19_1: D19.1 J24.2 Q8.5(D)
NetD20_1: D20.1 Q8.4(G) R55.2 ; port SOLENOID_7
NetD20_2: D20.2 R56.2
NetJ11_3: J11.3 R29.2
NetJ12_3: J12.3 R30.2
NetJ15_3: J15.3 R35#2.2
NetJ16_3: J16.3 R36#2.2
NetJ19#2_3: J19#2.3 R41#2.2
NetJ22_2: J22.2 R49.2
NetJ22_3: J22.3 R48.2
NetJ22_4: J22.4 R47.2
NetR29_1: R29.1 R31.2 ; port P_SNS_1
NetR30_1: R30.1 R32.2 ; port P_SNS_2
NetR35#2_1: R35#2.1 R39#2.2 ; port P_SNS_3
NetR36#2_1: R36#2.1 R40#2.2 ; port P_SNS_4
NetR41#2_1: R41#2.1 R44.2 ; port P_SNS_5
NetR48_1: R48.1 R52.2 ; port P_SNS_6_OR_Anemometer

Not connected (* = marked no-connect by the designer): J11 2; J12 2; J15 2; J16 2; J19#2 2; U6#2 2(NC) 5(NC) 7(NC)

### Notes on the sheet
- Add Switches to gates to manually Trigger Each Solenoid for testing and Stuff
- Replace R53 with 0 ohm if using Anemeter
- PROJECT
- SHEET
- Powered By
- Sheet
- of
- REVISION
- ssi.stanford.edu
- ENGINEER
- REVIEWER
- REVIEWED ON

### Library data of the parts
C22#2 C42 = 490-1519-1-ND: CAP CER 0603 0.1µF X7R 50V 10%; Manufacturer: Murata Electronics North America; Capacitance - pF (Machine readable): #NAME?; type: capacitor; Supplier Part Number 1: 490-1519-1-ND; Dielectric: X7R; Supplier 1: Digikey
C23#2 C43 = 490-3900-1-ND: CAP CER 0603 1µF X7R 16V 10%; Manufacturer: Murata Electronics North America; Capacitance - pF (Machine readable): #NAME?; type: capacitor; Supplier Part Number 1: 490-3900-1-ND; Dielectric: X7R; Supplier 1: Digikey
D7#2 D8#2 D11#2 D12#2 D15 D16 D19 = SCHOTTKY_B540C-13-F: Manufacturer: Diodes Inc; Voltage - Forward (Vf) (Max) @ If: 550mV @ 5A; Speed: Fast Recovery =< 500ns, > 200mA (Io); Current - Reverse Leakage @ Vr: 500µA @ 40V; Capacitance @ Vr, F: 300pF @ 4V, 1MHz; Supplier 1: Digi-Key; RoHS: RoHS Compliant; Category: Discrete Semiconductor Products; Stock 1: 22018; Pricing 1: 1=1.06, 10=0.912, 100=0.72, 250=0.624, 500=0.528, 1000=0.42 (USD); Diode Type: Schottky; Reverse Recovery Time (trr): -; Mounting Type: Surface Mount; Package / Case: DO-214AB, SMC; Supplier Device Package: SMC; Packaging: Cut Tape (CT); ComponentLink1URL: http://www.diodes.com/datasheets/ds13012.pdf; Datasheet: http://www.diodes.com/datasheets/ds13012.pdf; Supplier Part Number 1: B540C-FDICT-ND; Manufacturer Part Number: B540C-13-F
D9 D10 D13#2 D14#2 D17 D18 D20 = LED_C503B-GCS-CB0C0781: LED GREEN CLEAR 5MM ROUND T/H; pin to pad: 1>A 2>K; Manufacturer: Cree; Lens Colour: Colorless; Luminous Intensity: 24850mcd; Viewing Angle: 30°; Forward Current: 20mA; Forward Voltage: 3.2V; Lens Style: Dome; Dominant Wavelength: 527nm; Power Rating: 120mW; Reverse Voltage (DC): 5V; Number of LEDs: 1; Supplier 1: Digi-Key; Manufacturer Part Number: C503B-GCS-CB0C0781; Stock 1: 191; Pricing 1: 1=0.25, 10=0.236, 100=0.2184, 1000=0.1954, 50000=0.1814 (USD); Mount: Through Hole; Case/Package: Radial; Colour: Green; Min Operating Temperature: -40°C; Max Operating Temperature: 95°C; Illumination Colour: Green; Packaging: Bulk; Package Quantity: 500; Lens Transparency: Clear; Test Current: 20mA; Wavelength: 527nm; Length: 5.8mm; Height: 12.7mm; Width: 5mm; ComponentLink1URL: http://www.mouser.com/ds/2/90/cree.C503B%20BAS%20BAN%20BCS%20BCN%20GAS%20GAN%20GCS%20GCN%201094[1]-310350.pdf; ComponentLink1Description: http://www.mouser.com/ds/2/90/cree.C503B%20BAS%20BAN%20BCS%20BCN%20GAS%20GAN%20GCS%20GCN%201094[1]-310350.pdf; ComponentLink2URL: http://www.cree.com/led-components/media/documents/C503B-BAS-BAN-BCS-BCN-GAS-GAN-GCS-GCN-1094.pdf; ComponentLink2Description: http://www.cree.com/led-components/media/documents/C503B-BAS-BAN-BCS-BCN-GAS-GAN-GCS-GCN-1094.pdf; Supplier Part Number 1: C503B-GCS-CB0C0781-ND
J11 J12 J15 J16 J19#2 J22 J23 = MOLEX_2x2_0430450400: MICROFIT CONN HEADER R/A 4POS 3MM; Supplier 1: Digi-Key
J13 J14 J17 J18#2 J20 J21 J24 = MOLEX_1x2_1723101102: ULTRAFIT CONN HEADER R/A 2POS 3.5MM; Supplier 1: Digi-Key
Q2 Q3#2 Q4#2 Q5-Q8 = NFET_CSD16323Q3: MOSFET N-CH 25V 3.3X3.3 8-SON; Manufacturer: Texas Instruments; FET Type: MOSFET N-Channel, Metal Oxide; FET Feature: Logic Level Gate; Current - Continuous Drain (Id) @ 25°C: 21A (Ta), 60A (Tc); Rds On (Max) @ Id, Vgs: 4.5 mOhm @ 24A, 8V; Vgs(th) (Max) @ Id: 1.4V @ 250µA; Gate Charge (Qg) @ Vgs: 8.4nC @ 4.5V; Input Capacitance (Ciss) @ Vds: 1300pF @ 12.5V; Power - Max: 3W; Supplier 1: Digi-Key; Manufacturer Part Number: CSD16323Q3; RoHS: RoHS Compliant By Exemption; Category: Discrete Semiconductor Products; Stock 1: 23688; Pricing 1: 1=1.19, 10=1.061, 100=0.8271, 500=0.68404, 1000=0.43625 (USD); Packaging: Cut Tape (CT); Drain to Source Voltage (Vdss): 25V; Operating Temperature: -55°C ~ 150°C (TJ); Mounting Type: Surface Mount; Package / Case: 8-PowerTDFN; Supplier Device Package: 8-VSON (3.3x3.3); ComponentLink1URL: http://www.ti.com/lit/ds/symlink/csd16323q3.pdf; ComponentLink1Description: http://www.ti.com/lit/ds/symlink/csd16323q3.pdf
R29 R30 R33 R34#2 R35#2 R36#2 R41#2 R42 R43 R48 R50 R51 R55 = RES SMD 10K OHM 1% 1/10W 0603: Manufacturer Part Number: RC0603FR-0710KL; Manufacturer: Yageo; Resistance (Sortable): 10000; Power (Watts): 0.1W, 1/10W; Temperature Coefficient: ±100ppm/°C; Supplier 1: Digikey; Datasheets: http://www.yageo.com/documents/recent/PYu-RC_Group_51_RoHS_L_9.pdf; Image: //media.digikey.com/Renders/Yageo%20Renders/0603-(1608-Metric).jpg; Supplier Part Number 1: 311-10.0KHRCT-ND; Tolerance: ±1%; Operating Temperature: -55°C ~ 155°C
R31 R32 R39#2 R40#2 R44 R52 = RES SMD 20K OHM 1% 1/10W 0603: Manufacturer Part Number: RC0603FR-0720KL; Manufacturer: Yageo; Resistance (Sortable): 20000; Power (Watts): 0.1W, 1/10W; Temperature Coefficient: ±100ppm/°C; Supplier 1: Digikey; Datasheets: http://www.yageo.com/documents/recent/PYu-RC_Group_51_RoHS_L_9.pdf; Image: //media.digikey.com/Renders/Yageo%20Renders/0603-(1608-Metric).jpg; Supplier Part Number 1: 311-20.0KHRCT-ND; Tolerance: ±1%; Operating Temperature: -55°C ~ 155°C
R47 R49 = RES_0.0_OHM_1/8W_JUMP_0805_SMD: RES 0.0 OHM 1/8W JUMP 0805 SMD; Manufacturer: Panasonic Electronic Components; Manufacturer Part Number: ERJ-6GEY0R00V; Tolerance: Jumper; Power (Watts): 0.125W, 1/8W; Supplier 1: Digi-Key; RoHS: RoHS Compliant; Category: Resistors; Stock 1: 3323537; Pricing 1: 1=0.1, 10=0.024, 25=0.0172, 50=0.0132, 100=0.0097, 250=0.00744, 500=0.00594, 1000=0.00437 (USD); Packaging: Cut Tape (CT); Part Status: Active; Composition: Thick Film; Features: Automotive AEC-Q200; Temperature Coefficient: -; Operating Temperature: -55°C ~ 155°C; Package / Case: 0805 (2012 Metric); Supplier Device Package: 0805; Size / Dimension: 0.079" L x 0.049" W (2.00mm x 1.25mm); Height - Seated (Max): 0.028" (0.70mm); Number of Terminations: 2; Failure Rate: -; ComponentLink1URL: http://industrial.panasonic.com/www-cgi/jvcr13pz.cgi?E+PZ+3+AOA0001+ERJ6GEY0R00V+7+WW; ComponentLink1Description: http://industrial.panasonic.com/www-cgi/jvcr13pz.cgi?E+PZ+3+AOA0001+ERJ6GEY0R00V+7+WW; Supplier Part Number 1: P0.0ACT-ND
R57 = 311-20.0KHRCT-ND: RES SMD 20K OHM 1% 1/10W 0603; Manufacturer Part Number: RC0603FR-0720KL; Manufacturer: Yageo; Resistance (Sortable): 20000; Power (Watts): 0.1W, 1/10W; Temperature Coefficient: ±100ppm/°C; Supplier Part Number 1: 311-20.0KHRCT-ND; Supplier 1: Digikey; Datasheets: http://www.yageo.com/documents/recent/PYu-RC_Group_51_RoHS_L_9.pdf; Image: //media.digikey.com/Renders/Yageo%20Renders/0603-(1608-Metric).jpg; Tolerance: ±1%; Operating Temperature: -55°C ~ 155°C

## Sheet lvds.SchDoc
size Legal
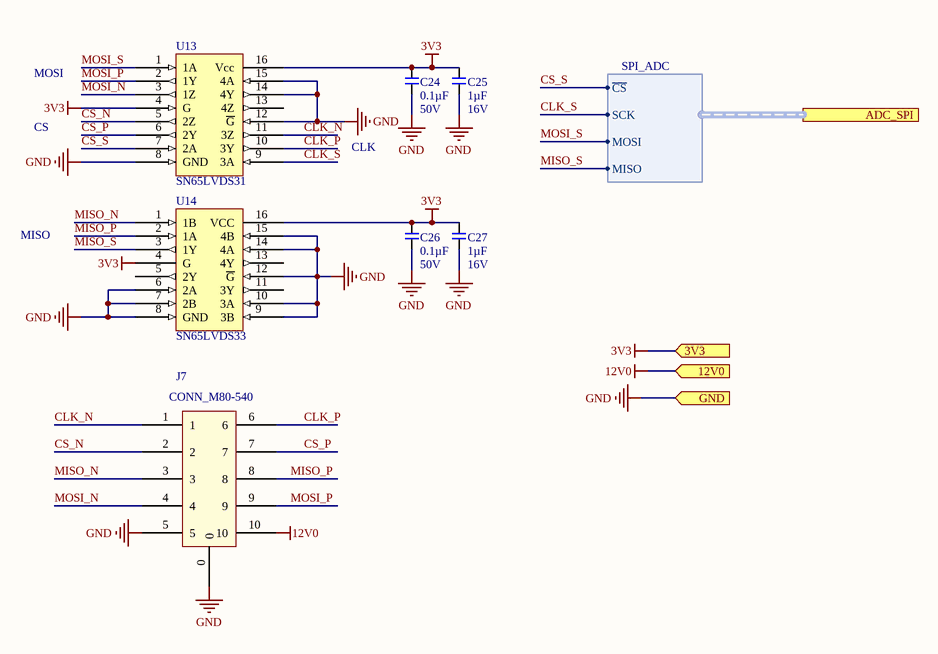
[diagram p9: lvds.SchDoc]

### Parts
(Parts that share a designator on the sheet are numbered #1, #2 ... from top to bottom, then left to right.)
C24#2  Capacitance (shorthand): 0.1µF  Rated Voltage: 50V  [C0603P]  (hidden comment: __template_cap)
C25#2  Capacitance (shorthand): 1µF  Rated Voltage: 16V  [C0603P]  (hidden comment: __template_cap)
C26#2  Capacitance (shorthand): 0.1µF  Rated Voltage: 50V  [C0603P]  (hidden comment: __template_cap)
C27#2  Capacitance (shorthand): 1µF  Rated Voltage: 16V  [C0603P]  (hidden comment: __template_cap)
J7  CONN_M80-540  [HARWIN-M80-5401042]
U13  SN65LVDS31  [16SOIC150]
U14  SN65LVDS33  [16SOIC150]

### Ports
3V3 (in), 12V0 (in), ADC_SPI (harness SPI_ADC), GND (in)

### Harnesses
SPI_ADC: SCK, MOSI, MISO, ~{CS}

### Nets
3V3: C24#2.1 C25#2.1 C26#2.1 C27#2.1 U13.4(G) U13.16(Vcc) U14.4(G) U14.16(VCC) ; port 3V3
12V0: J7.10 ; port 12V0
GND: C24#2.2 C25#2.2 C26#2.2 C27#2.2 J7.0 J7.5 U13.8(GND) U13.12(~{G}) U13.14(4Y) U13.15(4A) U14.6(2A) U14.7(2B) U14.8(GND) U14.9(3B) U14.10(3A) U14.12(~{G}) U14.14(4A) U14.15(4B) ; port GND
CLK_N: J7.1 U13.11(3Z)
CLK_P: J7.6 U13.10(3Y)
CLK_S: U13.9(3A) ; port ADC_SPI.SCK
CS_N: J7.2 U13.5(2Z)
CS_P: J7.7 U13.6(2Y)
CS_S: U13.7(2A) ; port ADC_SPI.~{CS}
MISO_N: J7.3 U14.1(1B)
MISO_P: J7.8 U14.2(1A)
MISO_S: U14.3(1Y) ; port ADC_SPI.MISO
MOSI_N: J7.4 U13.3(1Z)
MOSI_P: J7.9 U13.2(1Y)
MOSI_S: U13.1(1A) ; port ADC_SPI.MOSI

Not connected (* = marked no-connect by the designer): U13 13(4Z); U14 5(2Y) 11(3Y) 13(4Y)

### Notes on the sheet
- MOSI
- CS
- CLK
- MISO
- PROJECT
- SHEET
- Powered By
- Sheet
- of
- REVISION
- ssi.stanford.edu
- ENGINEER
- REVIEWER
- REVIEWED ON

### Library data of the parts
C24#2 C26#2 = 490-1519-1-ND: as C22#2 on sheet SolenoidsAndPressure; Supplier Part Number 1: 490-1519-1-ND; Dielectric: X7R; Supplier 1: Digikey
C25#2 C27#2 = 490-3900-1-ND: as C23#2 on sheet SolenoidsAndPressure; Supplier Part Number 1: 490-3900-1-ND; Dielectric: X7R; Supplier 1: Digikey
U13 = SN65LVDS31: SPI TO LVDS FOR DIFF TRANSMISSION
U14 = SN65LVDS33: LVDS TO SPI RECEIVER

## Nets that join several sheets
3V3: BatteryRegulators (FB3.2 TP7.1), LevelShifter (C17.1 U6#1.1 U6#1.8), SAMD51 (19 pins), SD (8 pins), Radio (C36.1 C37.1 U11.3 U11.8)
5V0: Quail (D1.2), BatteryRegulators (6 pins), MC33797 (C52.1 J2.2 R9.2 U5.10), LevelShifter (C16.1 U6#1.14)
12V0_SW: BatteryRegulators (13 pins), MC33797 (9 pins)
GND: BatteryRegulators (32 pins), MC33797 (12 pins), LevelShifter (C16.2 C17.2 U6#1.7), Blink_Blink_Beep_Boop (D5.2 D6.2 D7#1.2 D8#1.2), SAMD51 (29 pins), SD (C34.1 C35.2 U10.6), Radio (7 pins)
VBUS: Quail (D1.1), SAMD51 (C20.1 J18#1.1 U8.5)
BatterySense: BatteryRegulators (D3.2 R2.1 R4.2 TP6.1), SAMD51 (U9.15)
BUSY: SAMD51 (U9.83), Radio (U11.11)
CurrentSense: BatteryRegulators (R5.2 U1.4), SAMD51 (U9.16)
DIO1: SAMD51 (U9.82), Radio (U11.10)
LED1: Blink_Blink_Beep_Boop (R19.2), SAMD51 (U9.64)
LED2: Blink_Blink_Beep_Boop (R18.2), SAMD51 (U9.65)
LED3: Blink_Blink_Beep_Boop (R17.2), SAMD51 (U9.66)
LED4: Blink_Blink_Beep_Boop (R16.2), SAMD51 (U9.67)
NetTP1_1: Quail (TP1.1), SAMD51 (U9.23)
NetTP2_1: Quail (TP2.1), SAMD51 (U9.22)
NetTP3_1: Quail (TP3.1), SAMD51 (U9.21)
NetTP30_1: Quail (TP30.1), SAMD51 (U9.10)
NetTP31_1: Quail (TP31.1), SAMD51 (U9.95)
NetTP32_1: Quail (TP32.1), SAMD51 (U9.52)
NetTP33_1: Quail (TP33.1), SAMD51 (U9.61)
NetTP34_1: Quail (TP34.1), SAMD51 (U9.9)
NetTP35_1: Quail (TP35.1), SAMD51 (U9.97)
NetTP36_1: Quail (TP36.1), SAMD51 (U9.98)
NetTP37_1: Quail (TP37.1), SAMD51 (U9.99)
NetTP38_1: Quail (TP38.1), SAMD51 (U9.100)
NetTP39_1: Quail (TP39.1), SAMD51 (U9.8)
NetTP40_1: Quail (TP40.1), SAMD51 (U9.7)
NetTP41_1: Quail (TP41.1), SAMD51 (U9.3)
NetTP42_1: Quail (TP42.1), SAMD51 (U9.4)
NetTP43_1: Quail (TP43.1), SAMD51 (U9.5)
NetU9_70: SAMD51 (U9.70), Radio (U11.13)
NetU9_71: SAMD51 (U9.71), Radio (U11.16)
NetU9_72: SAMD51 (U9.72), Radio (U11.15)
NetU9_73: SAMD51 (U9.73), Radio (U11.14)
NRESET: SAMD51 (U9.84), Radio (U11.12)
PWR_FLT: BatteryRegulators (U4.7), SAMD51 (U9.6)
SD_CLK: SAMD51 (U9.33), SD (U10.5)
SD_CMD: SAMD51 (U9.26), SD (R38#1.2 U10.3)
SD_DAT0: SAMD51 (U9.27), SD (R39#1.2 U10.7)
SD_DAT1: SAMD51 (U9.28), SD (R41#1.2 U10.8)
SD_DAT2: SAMD51 (U9.29), SD (R40#1.2 U10.1)
SD_DAT3: SAMD51 (U9.32), SD (R37#1.2 U10.2)
SQB_CS: LevelShifter (U6#1.2), SAMD51 (U9.58)
SQB_MICO: LevelShifter (U6#1.5), SAMD51 (U9.59)
SQB_MOCI: LevelShifter (U6#1.3), SAMD51 (U9.57)
SQB_SCK: LevelShifter (U6#1.4), SAMD51 (U9.56)
SQUIB_CS: MC33797 (TP11.1 U5.30), LevelShifter (U6#1.13)
Squib_MICO: MC33797 (TP10.1 U5.9), LevelShifter (U6#1.10)
Squib_MOCI: MC33797 (TP8.1 U5.3), LevelShifter (U6#1.12)
Squib_SCK: MC33797 (TP9.1 U5.4), LevelShifter (U6#1.11)